# Altium schematic sheet MotorShield.SchDoc: ArduIMU V4 Motor Shield
size A4; DrawnBy: J.F.B.; Revision: 1; SheetNumber: 1; SheetTotal: 1
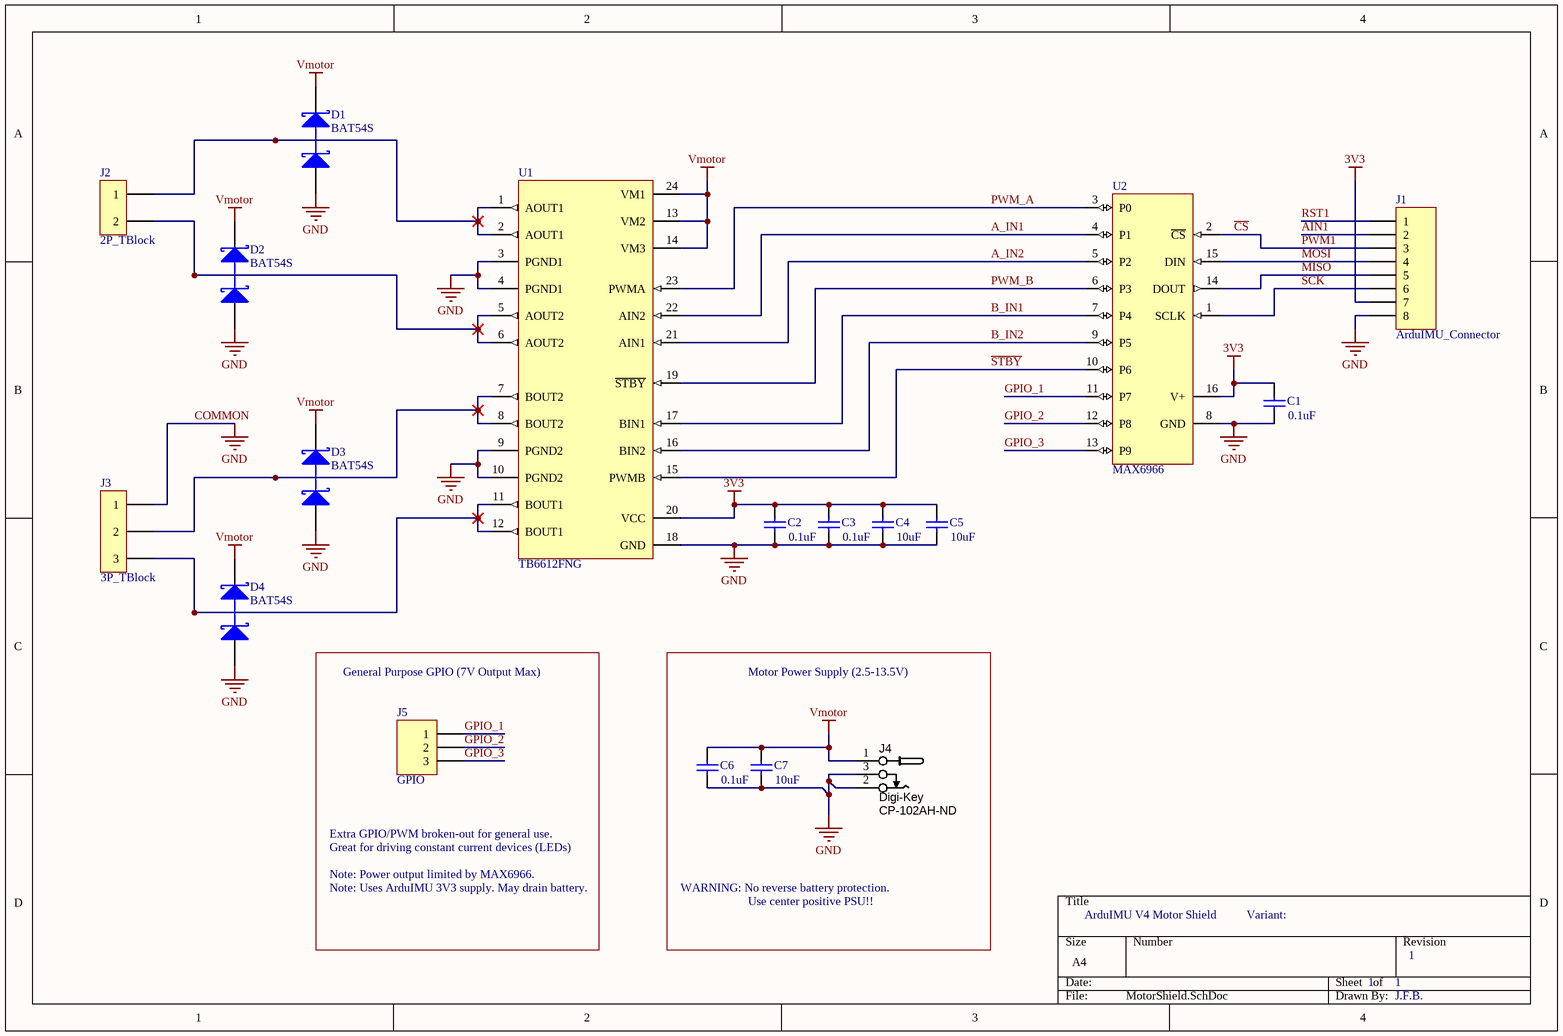
[diagram p0: MotorShield.SchDoc]

## Parts
C1  value 0.1uF  [6-0805]  (hidden comment: Cap)
C2  value 0.1uF  [6-0805]  (hidden comment: Cap)
C3  value 0.1uF  [6-0805]  (hidden comment: Cap)
C4  value 10uF  [6-0805]  (hidden comment: Cap)
C5  value 10uF  [6-0805]  (hidden comment: Cap)
C6  value 0.1uF  [6-0805]  (hidden comment: Cap)
C7  value 10uF  [6-0805]  (hidden comment: Cap)
D1  BAT54S  [SOT23_M]
D2  BAT54S  [SOT23_M]
D3  BAT54S  [SOT23_M]
D4  BAT54S  [SOT23_M]
J1  ArduIMU_Connector  [HDR1X8]
J2  2P_TBlock  [2P_TBlock]
J3  3P_TBlock  [3P_TBlock]
J4  Supplier 1: Digi-Key  Supplier Part Number 1: CP-102AH-ND  [CONN_PWR_JACK_2.1x5.5mm]  (hidden comment: CONN_PWR_JACK_2.1x5.5mm)
J5  GPIO  [HDR1X3]
U1  TB6612FNG  [SSOP-SS24_L]
U2  MAX6966  [QSOP-QR16_L]

## Nets
3V3: C1.2 C2.2 C3.2 C4.2 C5.2 J1.7 U1.20(VCC) U2.16(V+)
COMMON: C1.1 C2.1 C3.1 C4.1 C5.1 C6.1 C7.1 D1.1(A) D2.1(A) D3.1(A) D4.1(A) J1.8 J3.1 J4.2 J4.3 U1.3(PGND1) U1.4(PGND1) U1.9(PGND2) U1.10(PGND2) U1.18(GND) U2.8(GND)  [also labelled GND]
Vmotor: C6.2 C7.2 D1.2(K) D2.2(K) D3.2(K) D4.2(K) J4.1 U1.13(VM2) U1.14(VM3) U1.24(VM1)
A_IN1: U1.22(AIN2) U2.4(P1)
A_IN2: U1.21(AIN1) U2.5(P2)
AIN1: J1.2
B_IN1: U1.17(BIN1) U2.7(P4)
B_IN2: U1.16(BIN2) U2.9(P5)
~{CS}: J1.3 U2.2(~{CS})  [also labelled PWM1]
GPIO_1: J5.1 U2.11(P7)
GPIO_2: J5.2 U2.12(P8)
GPIO_3: J5.3 U2.13(P9)
MISO: J1.5 U2.14(DOUT)
MOSI: J1.4 U2.15(DIN)
PWM_A: U1.23(PWMA) U2.3(P0)
PWM_B: U1.19(~{STBY}) U2.6(P3)
RST1: J1.1
~{STBY}: U1.15(PWMB) U2.10(P6)
SCK: J1.6 U2.1(SCLK)
NetD1_3: D1.3(C) J2.1 U1.1(AOUT1) U1.2(AOUT1)
NetD2_3: D2.3(C) J2.2 U1.5(AOUT2) U1.6(AOUT2)
NetD3_3: D3.3(C) J3.2 U1.7(BOUT2) U1.8(BOUT2)
NetD4_3: D4.3(C) J3.3 U1.11(BOUT1) U1.12(BOUT1)

## Notes on the sheet
- General Purpose GPIO (7V Output Max)
- Motor Power Supply (2.5-13.5V)
- Extra GPIO/PWM broken-out for general use.
- Great for driving constant current devices (LEDs)
- Note: Power output limited by MAX6966.
- Note: Uses ArduIMU 3V3 supply. May drain battery.
- WARNING: No reverse battery protection.
- Use center positive PSU!!
- Variant:

## Library data of the parts
C1-C7 = Cap: Capacitor; Published: 8-Jun-2000; LatestRevisionDate: 17-Jul-2002; LatestRevisionNote: Re-released for DXP Platform.; PackageReference: RAD-0.3; Publisher: Altium Limited; PackageDescription: Radial Cap, Thru-Hole; 2 Leads; 0.3 in Pin Spacing
D1-D4 = BAT54S: Schottky Barrier Double Diode; Published: 17-Sep-2003; LatestRevisionDate: 12-Dec-2006; LatestRevisionNote: IPC-7351 Footprint Added.; DatasheetVersion: 4-Mar-2002; PackageVersion: May-1999; PackageReference: SOT23; Publisher: Altium Limited; PackageDescription: 3-Pin SOT-23 Package 0.95 mm Pitch, 2.3 mm Lead Span; ComponentLink1Description: Manufacturer Link; ComponentLink1URL: http://www.semiconductors.philips.com/; ComponentLink2Description: Datasheet; ComponentLink2URL: http://www.semiconductors.philips.com/acrobat/datasheets/BAT54_SERIES_4.pdf
J1 = Header 8: Header, 8-Pin; LatestRevisionDate: 17-Jul-2002; LatestRevisionNote: Re-released for DXP Platform.; Publisher: Altium Limited
J2 = 2P_TBlock: 2 Pin Terminal Block
J3 = 3P_TBlock: 3 Pin Terminal Block
J4 = CONN_PWR_JACK_2.1x5.5mm: Power Connector, THT, 2.1mm ID, 5.5mm OD; Manufacturer 1: CUI Inc; Manufacturer Part Number 1: PJ-102AH; SCDType: undef; Category: Connectors; Mounting Type: Through Hole; Package / Case: PCB mount; Value: 2.1mm ID, 5.5mm OD
J5 = Header 3: Header, 3-Pin; LatestRevisionDate: 17-Jul-2002; LatestRevisionNote: Re-released for DXP Platform.; Publisher: Altium Limited
U1 = TB6612FNG: Driver IC for Dual DC motor
U2 = MAX6966: 10-Port Constant-Current LED Drivers and I/O  Expanders with PWM Intensity Control